# Altium schematic sheet RaspPI.SchDoc
size A4; SheetNumber: 2; SheetTotal: 2
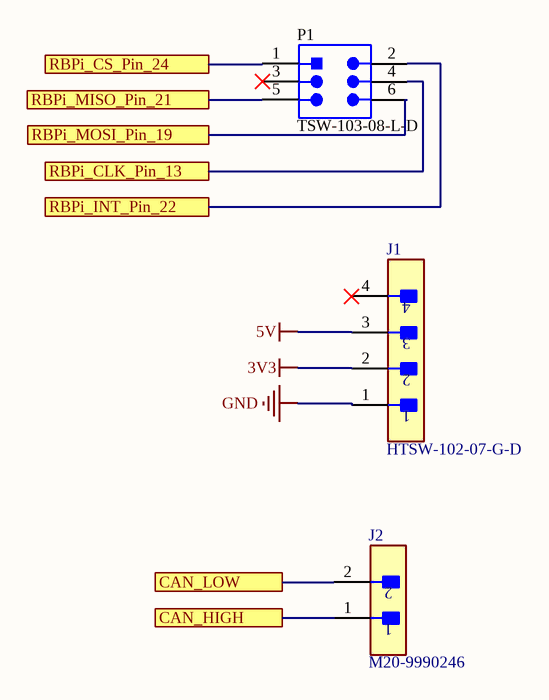
[diagram p0: RaspPI.SchDoc]

## Parts
J1  HTSW-102-07-G-D  [FP-HTSW-102-07-G-D-MFG]
J2  M20-9990246  [FP-M20-9990246-MFG]
P1  TSW-103-08-L-D  [SMTC-TSW-103-08-L-D_V]

## Ports
CAN_HIGH, CAN_LOW, RBPi_CLK_Pin_13, RBPi_CS_Pin_24, RBPi_INT_Pin_22, RBPi_MISO_Pin_21, RBPi_MOSI_Pin_19

## Nets
3V3: J1.2
5V: J1.3
GND: J1.1
CAN_HIGH: J2.1 ; port CAN_HIGH
CAN_LOW: J2.2 ; port CAN_LOW
RBPi_CLK_Pin_13: P1.4 ; port RBPi_CLK_Pin_13
RBPi_CS_Pin_24: P1.1 ; port RBPi_CS_Pin_24
RBPi_INT_Pin_22: P1.2 ; port RBPi_INT_Pin_22
RBPi_MISO_Pin_21: P1.5 ; port RBPi_MISO_Pin_21
RBPi_MOSI_Pin_19: P1.6 ; port RBPi_MOSI_Pin_19

Not connected (* = marked no-connect by the designer): J1 4*; P1 3*

## Library data of the parts
J1 = CMP-02766-000010-1: CONN HEADER VERT 4POS 2.54MM; Manufacturer: Samtec; Voltage Rating: 550V; Conn Orientation: Straight; Number Of Contacts: 4; Description: Connector Header Through Hole 4 position 0.100" (2.54mm); Conn Gender: Male; Current Rating: 6.3A; Number Of Rows: 2; Category: Conn; Temperature: -55°C to +125°C; Automotive: No; Digikey Description: CONN HEADER VERT 4POS 2.54MM; ComponentLink2URL: http://suddendocs.samtec.com/catalog_english/htsw_th.pdf; Device Class L2: Headers and Wire Housings; Mouser Description: Conn Unshrouded Header HDR 4 POS 2.54mm Solder ST Thru-Hole Bag; Manufacturer Part Number: HTSW-102-07-G-D; Temperature Range High: +125°C; Contact Material: Gold,Nickel; Temperature Range Low: -55°C; ComponentLink2Description: Datasheet; Device Class L1: Connectors; Pitch: 2.54mm; Octopart: https://octopart.com/htsw-102-07-g-d-samtec-10531767; RoHS: TRUE; Package: HTSW-102-07-G-D; Lead Free: Yes; Device Class L3: unset; Height: 8.71mm
J2 = CMP-15831-000009-1: CONN HEADER VERT 2POS 2.54MM; Manufacturer: Harwin; Conn Gender: Male; Conn Orientation: Vertical; Number Of Contacts: 2; Current Rating: 3A; ComponentLink2URL: https://cdn.harwin.com/pdfs/M20-999.pdf; ComponentLink2Description: Datasheet; Package: M20-9990246; Temperature: -40°C to +105°C; Octopart: https://octopart.com/m20-9990246-harwin-2590635; Mouser Description: 2.54mm (0.1") Pitch SIL Vertical PC Tail Pin Header, 6.1mm mating pin height, tin, 2 contacts; Temperature Range High: +105°C; Device Class L1: Connectors; RoHS: TRUE; Automotive: No; Height: 8.99mm; Number Of Rows: 1; Contact Material: Tin,Nickel; Category: Conn; Pitch: 2.54mm; Lead Free: Yes; Digikey Description: CONN HEADER VERT 2POS 2.54MM; Manufacturer Part Number: M20-9990246; Temperature Range Low: -40°C; Device Class L3: unset; Device Class L2: Headers and Wire Housings
P1 = CMP-1024-00336-5: Male Header, Pitch 2.54 mm, 2 x 3 Position, Height 8.38 mm, Tail Length 5.08 mm, -55 to 125 degC, RoHS, Bulk; Manufacturer: Samtec; DatasheetVersion: 04/2012; ComponentLink3URL: http://suddendocs.samtec.com/prints/tsw-xxx-xx-x-x-xx-xxx-footprint.pdf; PackageReference: TSW-103-08-L-D; Mounting Technology: Through Hole; Min Operating Temperature: -55 degC; ComponentLink2Description: Datasheet; Lead Pitch: 2.54 mm; ComponentLink1Description: Manufacturer URL; Mount: Through Hole; ComponentLink1URL: http://www.samtec.com/; ComponentLink3Description: Package Specification; Max Operating Temperature: 125 degC; PackageDescription: Male Header, Pitch 2.54 mm, 2 x 3 Position, Height 8.38 mm, Tail Length 5.08 mm; ComponentLink2URL: https://datasheet.ciiva.com/25618/0900766b81154476-25618436.pdf; RoHSCompliant: true